# EAGLE schematic TimerModule (EAGLE 7.2.0)
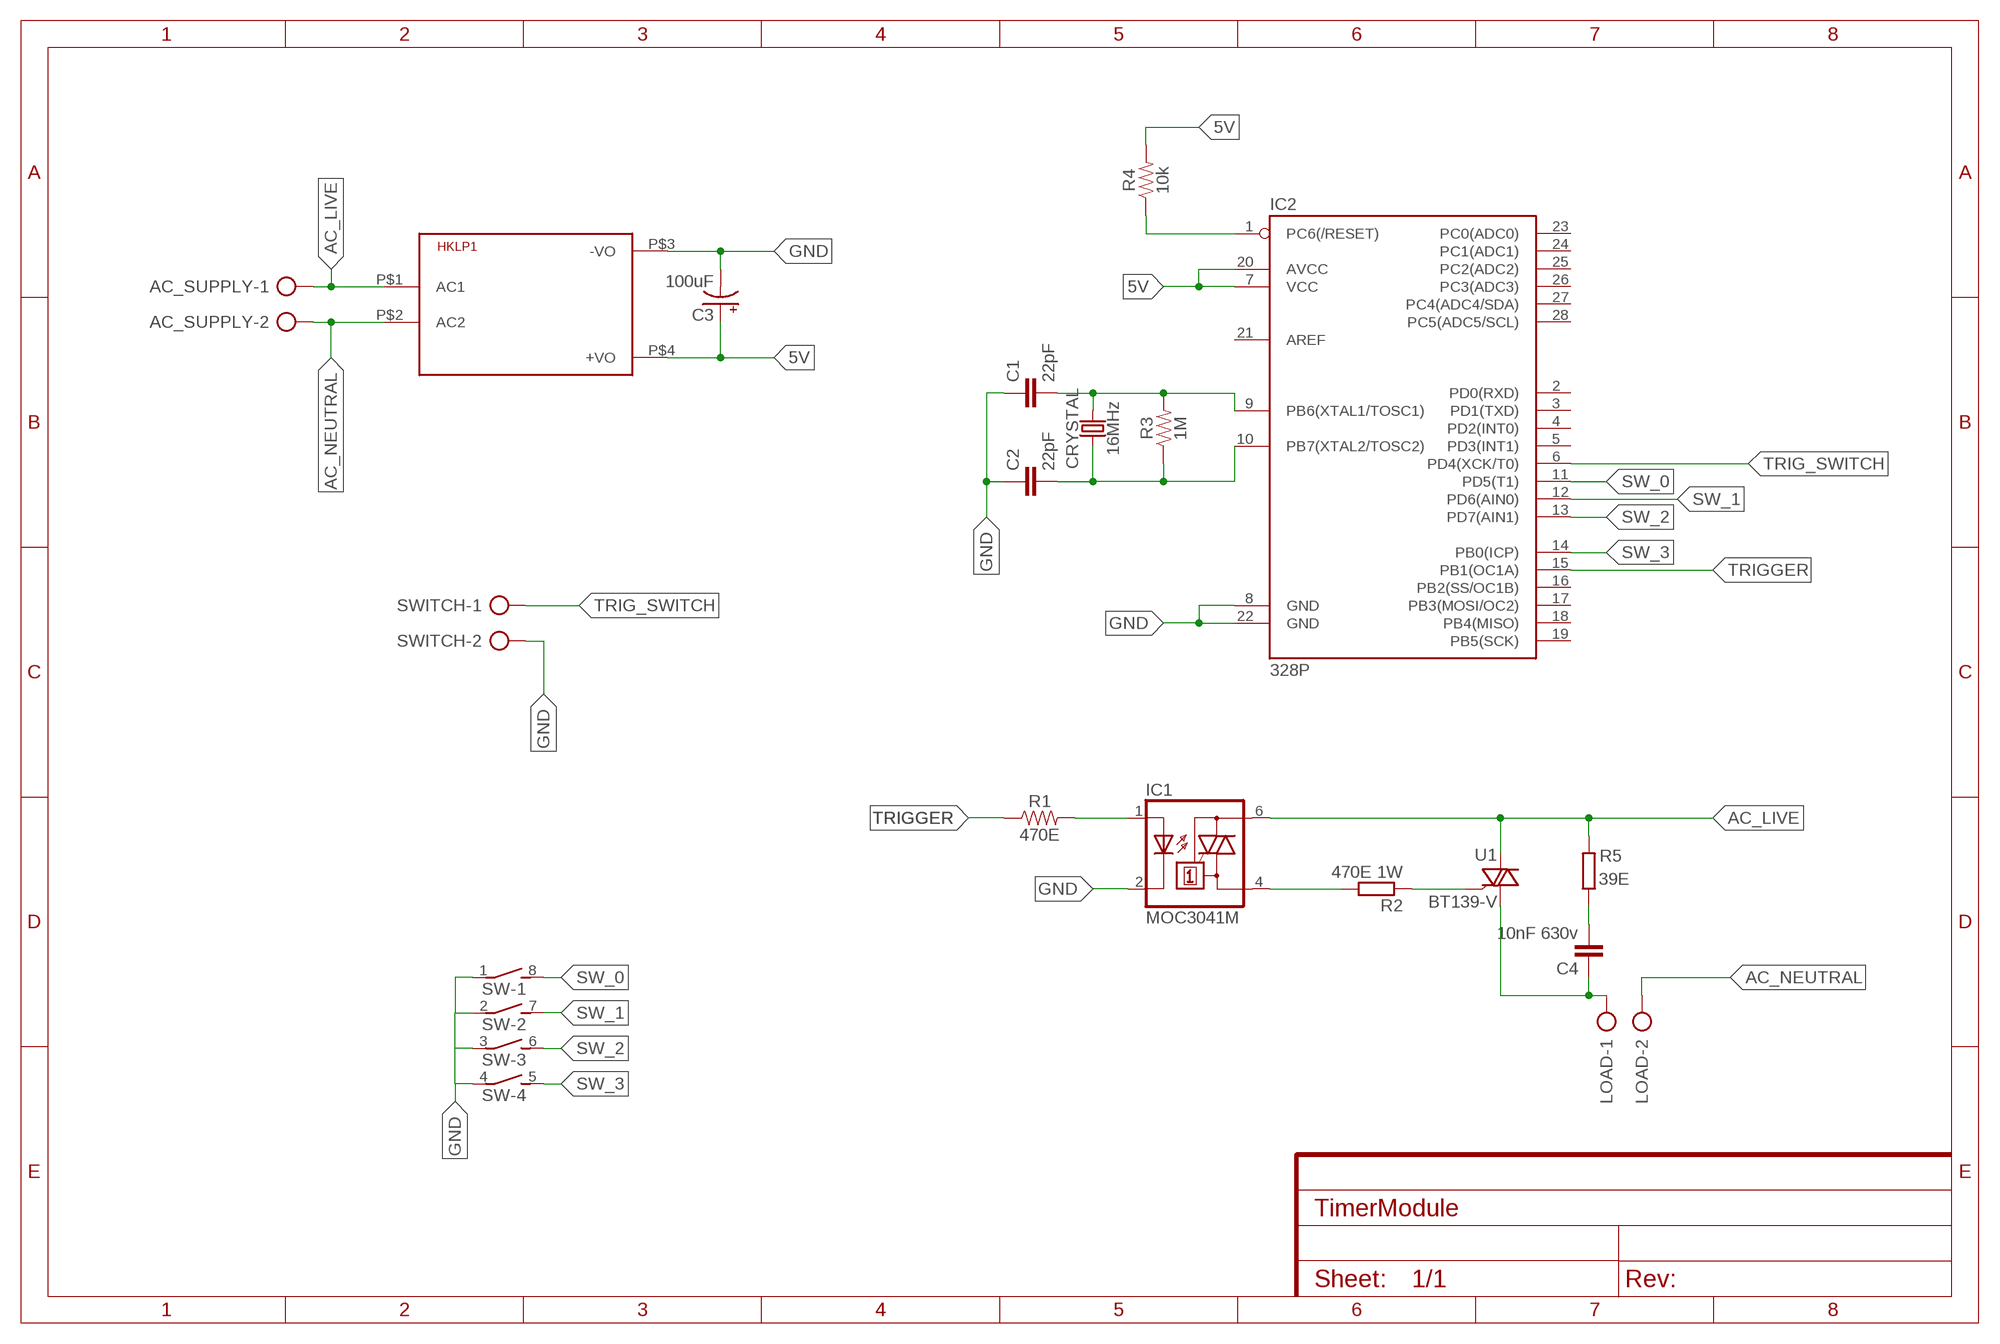
[diagram p0: schematic, sheet 1]

## Parts
AC_SUPPLY  AK300/2  [AK300/2]
C1  22pF  22PF-PTH-2.54MM-200V-5%  [CAP-PTH-2.54]
C2  22pF  22PF-PTH-2.54MM-200V-5%  [CAP-PTH-2.54]
C3  100uF  CPOL-USE2.5-6  [E2,5-6]
C4  10nF 630v  C7.5/3  [C7.5B3]
CRYSTAL  16MHz  CRYSTAL-16MHZPTH-HC49US  [HC49US]
HKLP1  HKLPM01  [HKLPM01]
IC1  MOC3041M  MOC3031M  [DIL06]
IC2  328P  ATMEGA328P_PDIP  [DIP28]
LOAD  AK300/2  [AK300/2]
R1  470E  1KOHM-HORIZ-1/4W-1%  [AXIAL-0.3]
R2  470E 1W  R-EU_0309/10  [0309/10]
R3  1M  1KOHM-HORIZ-1/4W-1%  [AXIAL-0.3]
R4  10k  1KOHM-HORIZ-1/4W-1%  [AXIAL-0.3]
R5  39E  R-EU_0309/10  [0309/10]
SW  DIP04S  [DIP04S]
SWITCH  AK300/2  [AK300/2]
U1  BT139-V  BT138-V  [TO220BV]

## Nets
5V: C3.+ HKLP1.P$4(+VO) IC2.7(VCC) IC2.20(AVCC) R4.P$2
AC_LIVE: AC_SUPPLY.1 HKLP1.P$1(AC1) IC1.6(A2) R5.2 U1.T2(A2)
AC_NEUTRAL: AC_SUPPLY.2 HKLP1.P$2(AC2) LOAD.2
GND: C1.1 C2.1 C3.- HKLP1.P$3(-VO) IC1.2(C) IC2.8(GND) IC2.22(GND) SW.1 SW.2 SW.3 SW.4 SWITCH.2
N$1: C1.2 CRYSTAL.2 IC2.9(PB6(XTAL1/TOSC1)) R3.P$2
N$2: IC1.4(A1) R2.2
N$3: R2.1 U1.G
N$4: C4.1 LOAD.1 U1.T1(A1)
N$5: IC1.1(A) R1.P$2
N$6: C2.2 CRYSTAL.1 IC2.10(PB7(XTAL2/TOSC2)) R3.P$1
N$7: IC2.1(PC6(/RESET)) R4.P$1
N$8: C4.2 R5.1
SW_0: IC2.11(PD5(T1)) SW.8
SW_1: IC2.12(PD6(AIN0)) SW.7
SW_2: IC2.13(PD7(AIN1)) SW.6
SW_3: IC2.14(PB0(ICP)) SW.5
TRIG_SWITCH: IC2.6(PD4(XCK/T0)) SWITCH.1
TRIGGER: IC2.15(PB1(OC1A)) R1.P$1
Unconnected: IC2.2(PD0(RXD)) IC2.3(PD1(TXD)) IC2.4(PD2(INT0)) IC2.5(PD3(INT1)) IC2.16(PB2(SS/OC1B)) IC2.17(PB3(MOSI/OC2)) IC2.18(PB4(MISO)) IC2.19(PB5(SCK)) IC2.21(AREF) IC2.23(PC0(ADC0)) IC2.24(PC1(ADC1)) IC2.25(PC2(ADC2)) IC2.26(PC3(ADC3)) IC2.27(PC4(ADC4/SDA)) IC2.28(PC5(ADC5/SCL))

## Library data of the parts
AC_SUPPLY LOAD SWITCH = con-ptr500:AK300/2: CONNECTOR; OC_FARNELL: unknown; OC_NEWARK: unknown
C1 C2 = SparkFun-Capacitors:22PF: 22pF ceramic capacitors A capacitor is a passive two-terminal electrical component used to store electrical energy temporarily in an electric field.; PROD_ID: CAP-09128
C3 = adafruit:CPOL-US: POLARIZED CAPACITOR, American symbol
C4 = capacitor-wima:C: CAPACITOR naming: grid - package width
CRYSTAL = SparkFun-Clocks:CRYSTAL-16MHZ: 16MHz Crystal Digikey Example <http://www.digikey.com/product-search/en?keywords=535-9122-1-ND> Frequency: 16MHz Frequency Stability: ±50ppm Frequency Tolerance: ±20ppm Load Capacitance: 18pF SparkFun Products: Pro Micro -5V/16MHz <https://www.sparkfun.com/products/12640> SparkFun Serial Enabled LCD Kit <https://www.sparkfun.com/products/10097>; PROD_ID: XTAL-08181; SF_ID: COM-00536
HKLP1 = HKLPM01:HKLPM01
IC1 = optocoupler:MOC30*: 6-Pin DIP Zero-Cross Optoisolators Triac Driver Output (250/400 Volt Peak) Source: Data sheet <http://www.fairchildsemi.com/ds/MO/MOC3031M.pdf> The old path of data sheet not more available 2013-05-06.; MF: FAIRCHILD SEMICONDUCTOR; MPN: MOC3031M; OC_FARNELL: 9875964; OC_NEWARK: 78K6089
IC2 = SparkFun-IC-Microcontroller:ATMEGA328P_PDIP: Atmel 328P Through hole ATMEGA328P uC used in the Arduino 32kb flash, 1k EEPROM, 2k SRAM Datasheet <http://www.sparkfun.com/datasheets/Components/SMD/ATMega328.pdf> SparkFun Products Storefront component: AVR 28 Pin 20MHz 32K 6A/D - ATMega328P <https://www.sparkfun.com/products/9061> (COM-09061) SparkFun Simon Says - Through-Hole Soldering Kit <https://www.sparkfun.com/products/10547> (KIT-10547) SparkFun Learn to Solder - Simon Says <https://www.sparkfun.com/products/13708> (KIT-13708) SparkFun BigTime Watch Kit <https://www.sparkfun.com/products/11734> (KIT-11734) SparkFun ClockIt <https://www.sparkfun.com/products/10930> (KIT-10930) SparkFun Serial Enabled LCD Kit <https://www.sparkfun.com/products/10097> (LCD-10097) SparkFun Simon Tilts - Through Hole Soldering Kit <https://www.sparkfun.com/products/12634> (KIT-12634) SparkFun Frequency Counter Kit <https://www.sparkfun.com/products/10140> (KIT-10140) FabFM Radio Kit <https://www.sparkfun.com/products/11043> (KIT-11043) SparkFun Binary Blaster Kit <https://www.sparkfun.com/products/12037> (KIT-12037) SparkFun Metro-Gnome <https://www.sparkfun.com/products/9236> (KIT-09236) ATmega328 with Arduino Optiboot (Uno) <https://www.sparkfun.com/products/10524> (DEV-10524); PROD_ID: IC-09136
R1 R3 R4 = SparkFun-Resistors:1KOHM: 1kΩ resistor A resistor is a passive two-terminal electrical component that implements electrical resistance as a circuit element. Resistors act to reduce current flow, and, at the same time, act to lower voltage levels within circuits. - Wikipedia; PROD_ID: RES-12182; VALUE: 1k
R2 R5 = resistor:R-EU_: RESISTOR, European symbol
SW = switch-dil:DIP04S: DIL/CODE SWITCH; OC_FARNELL: unknown; OC_NEWARK: unknown
U1 = triac:BT138: TRIAC Source: http://www.semiconductors.philips.com BT138_SERIES_2.pdf